# EasyEDA Pro project H桥.eprj, schematic 单相_TO220
Board Name: 单相_直插; Create Date: 2025-08-05; Page Name: P1; Project Name: H桥; Schematic Name: 单相_直插; Update Date: 2025-08-12; Company: 嘉立创EDA; Page Size: A4; Version: V1.0
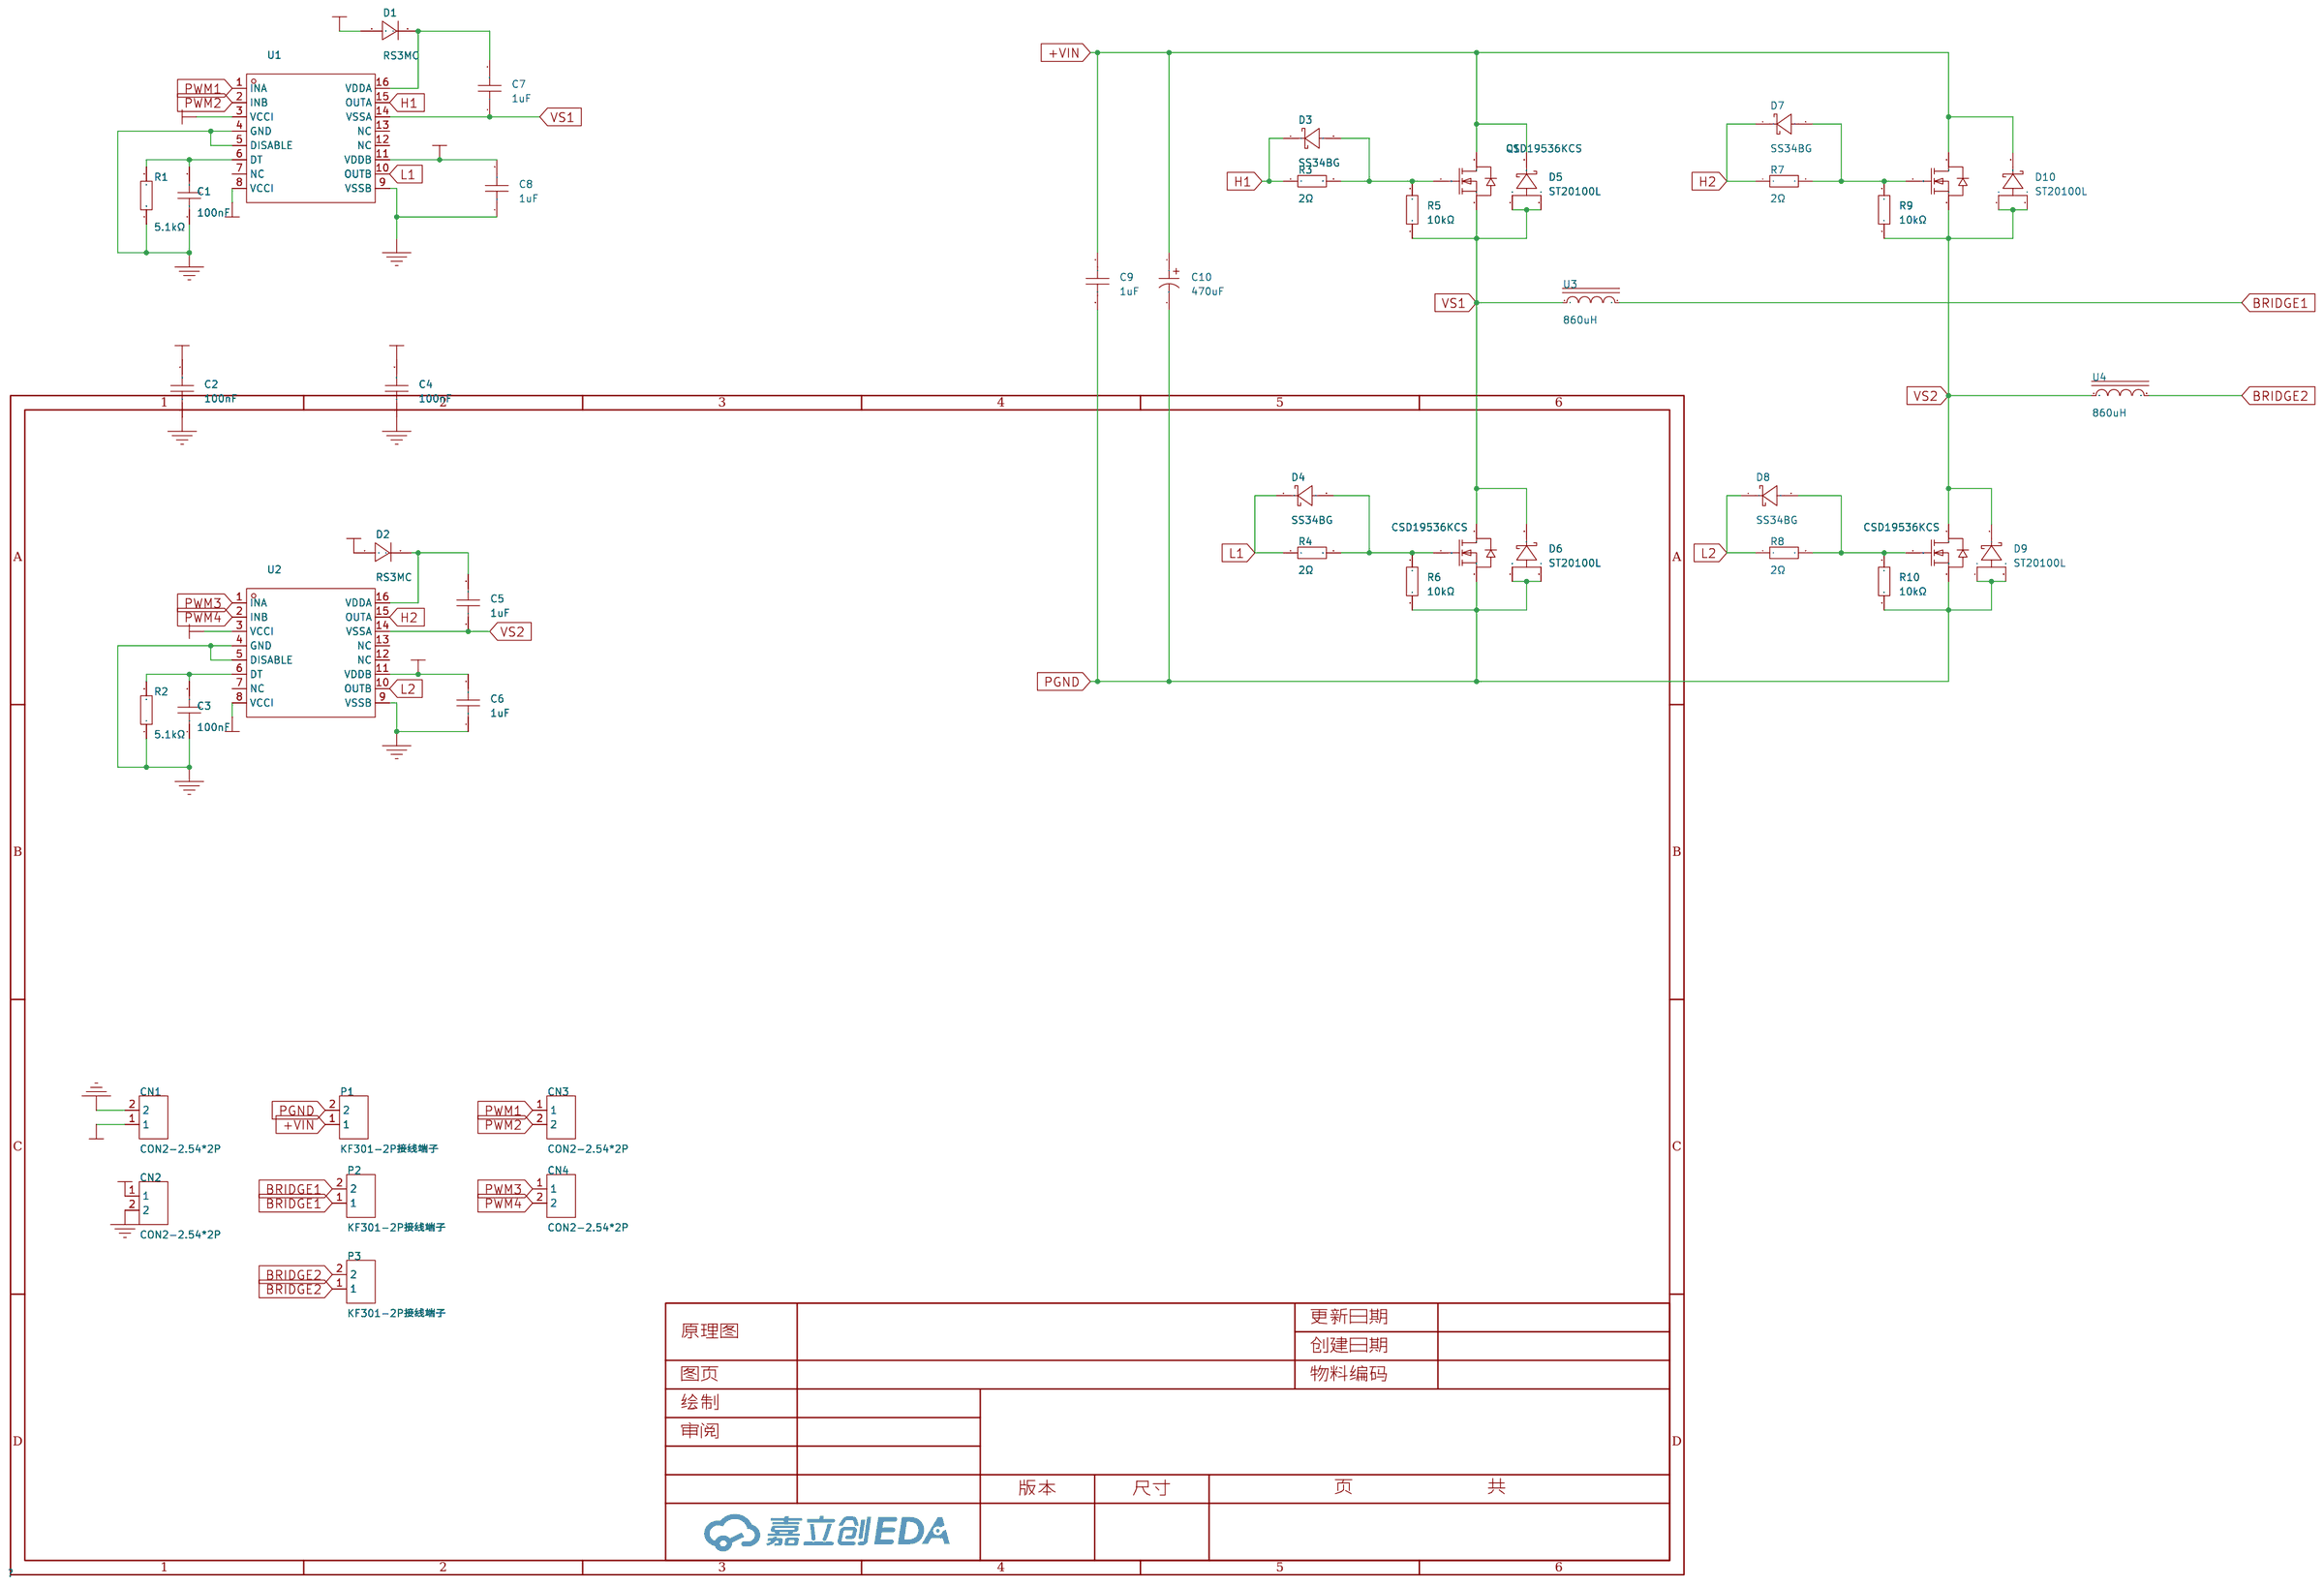
[diagram p0: schematic sheet]

## Parts
C1  100nF  [C0805]
C2  100nF  [C0805]
C3  100nF  [C0805]
C4  100nF  [C0805]
C5  1uF  [C0805]
C6  1uF  [C0805]
C7  1uF  [C0805]
C8  1uF  [C0805]
C9  1uF  [CAP-TH_L26.5-W10.0-P22.50-D1.4]
C10  470uF  [CAP-TH_BD16.0-P7.50-D1.2-FD]
CN1  CON2-2.54*2P  [CONN-TH_2P-P2.54-V]
CN2  CON2-2.54*2P  [CONN-TH_2P-P2.54-V]
CN3  CON2-2.54*2P  [CONN-TH_2P-P2.54-V]
CN4  CON2-2.54*2P  [CONN-TH_2P-P2.54-V]
D1  RS3MC  [SMC_L7.1-W6.2-LS8.1-R-RD]
D2  RS3MC  [SMC_L7.1-W6.2-LS8.1-R-RD]
D3  SS34BG  [SMB_L4.6-W3.6-LS5.3-RD]
D4  SS34BG  [SMB_L4.6-W3.6-LS5.3-RD]
D5  ST20100L  [TO-277_3P-L5.7-W4.2-LS6.5-BR]
D6  ST20100L  [TO-277_3P-L5.7-W4.2-LS6.5-BR]
D7  SS34BG  [SMB_L4.6-W3.6-LS5.3-RD]
D8  SS34BG  [SMB_L4.6-W3.6-LS5.3-RD]
D9  ST20100L  [TO-277_3P-L5.7-W4.2-LS6.5-BR]
D10  ST20100L  [TO-277_3P-L5.7-W4.2-LS6.5-BR]
P1  KF301-2P接线端子  [CONN-TH_XY301V-A-5.0-2P]
P2  KF301-2P接线端子  [CONN-TH_XY301V-A-5.0-2P]
P3  KF301-2P接线端子  [CONN-TH_XY301V-A-5.0-2P]
Q1  CSD19536KCS  [TO-220-3_L10.0-W4.5-P2.54-L]
Q2  CSD19536KCS  [TO-220-3_L10.0-W4.5-P2.54-L]
Q3  CSD19536KCS  [TO-220-3_L10.0-W4.5-P2.54-L]
Q4  CSD19536KCS  [TO-220-3_L10.0-W4.5-P2.54-L]
R1  20kΩ  [R0805]
R2  20kΩ  [R0805]
R3  2Ω  [R0805]
R4  2Ω  [R0805]
R5  10kΩ  [R0805]
R6  10kΩ  [R0805]
R7  2Ω  [R0805]
R8  2Ω  [R0805]
R9  10kΩ  [R0805]
R10  10kΩ  [R0805]
U1  UCC21520  [SOIC-16_L10.3-W7.5-P1.27-LS10.3-BL]
U2  UCC21520  [SOIC-16_L10.3-W7.5-P1.27-LS10.3-BL]
U3  860uH  [IND-TH_L29.0-W16.0-P14.00-D0.8]
U4  860uH  [IND-TH_L29.0-W16.0-P14.00-D0.8]

## Library data of the parts
C1 C3 = 1C25X7R473K100B: 容值:47nF;精度:±10%;额定电压:100V;温度系数:X7R;; LCSC Part Name: 47nF ±10% 100V; Supplier Part: C1630512; Manufacturer: VISHAY(威世); Supplier Footprint: 插件,P=6.35mm; JLCPCB Part Class: Extended Part; Datasheet: https://atta.szlcsc.com/upload/public/pdf/source/20210701/0CF1A7AD3406E72B391D35880AF61B15.pdf; Supplier: LCSC; Tolerance: ±10%; Voltage Rated: 100V; Temperature Coefficient: X7R
C2 C4-C8 = CAP_0805: Supplier Footprint: 0805
C9 = C322J474J90C000: LCSC Part Name: 470nF ±5% 630V; Supplier Part: C401319; Manufacturer: faratronic(厦门法拉); Supplier Footprint: 插件,P=22.5mm; JLCPCB Part Class: 扩展库; Datasheet: https://atta.szlcsc.com/upload/public/pdf/source/20190702/C401136_4E449A5F5E1485A05AFFA403AF8D4B3E.pdf; Supplier: LCSC; Tolerance: ±5%; Voltage Rated: 630V
C10 = CD11Z 100V470μF: 容值:470uF;额定电压:100V;纹波电流:-;等效串联电阻:-;; LCSC Part Name: 470uF 100V; Supplier Part: C1692765; Manufacturer: DMEGC(东磁); Supplier Footprint: 插件,D16xL25mm; JLCPCB Part Class: 扩展库; Datasheet: https://atta.szlcsc.com/upload/public/pdf/source/20210111/C1692765_3DA9E861BF574BA4CB3EF792989E2CF7.pdf; Supplier: LCSC; Rated Voltage: 100V
CN1-CN4 = CON2-2.54*2P: Supplier Part: C9900003238; Supplier Footprint: TH-2P; JLCPCB Part Class: Extended Part; Supplier: LCSC
D1 D2 = RS3MC_C15283: 二极管配置:独立式;正向压降(Vf):1.3V@3A;直流反向耐压(Vr):1kV;整流电流:3A;反向恢复时间(trr):500ns;; LCSC Part Name: 电压:1kV 电流:3A; Supplier Part: C15283; Manufacturer: MDD(辰达半导体); Supplier Footprint: SMC; JLCPCB Part Class: 扩展库; Datasheet: https://atta.szlcsc.com/upload/public/pdf/source/20240809/311FA8487617F5AA976E3BC15CA3A541.pdf; Supplier: LCSC; Diode Configuration: 独立式; Forward Voltage (Vf@If): 1.3V@3A; Reverse Voltage (Vr): 1kV; Rectified Current: 3A; Reverse Leakage Current: 5uA@1kV; Reverse Recovery Time (trr): 500ns; Operating Temperature: -55℃~+150℃@(Tj)
D3 D4 D7 D8 = SS34BG: LCSC Part Name: 电压:40V 电流:3A; Supplier Part: C719397; Manufacturer: SHIKUES(时科); Supplier Footprint: SMB; JLCPCB Part Class: 扩展库; Datasheet: https://atta.szlcsc.com/upload/public/pdf/source/20200825/C719396_E39605378EBDC67A0B7AD53C9B61FDD8.pdf; Supplier: LCSC; Diode Configuration: 独立式; Forward Voltage (Vf@If): 550mV@3A; Reverse Voltage (Vr): 40V; Average Rectified Current (Io): 3A; Reverse Leakage Current (Ir): 500uA@40V
D5 D6 D9 D10 = ST20100L: LCSC Part Name: 电压:100V 电流:20A; Supplier Part: C2693410; Manufacturer: CJ(江苏长电/长晶); Supplier Footprint: TO-277; JLCPCB Part Class: 扩展库; Datasheet: https://atta.szlcsc.com/upload/public/pdf/source/20210330/C2693410_9551F5ED840A67394421895091158B3C.pdf; Supplier: LCSC; Diode Configuration: 独立式; Voltage - Forward(Vf@If): 650mV@20A; Voltage - DC Reverse(Vr): 100V; Current - Rectified: 20A; Reverse Leakage Current (Ir): 30uA@100V
P1-P3 = KF301-2P接线端子: Supplier Part: C9900016950; Supplier Footprint: CK301-2P; JLCPCB Part Class: 扩展库; Supplier: LCSC
Q1-Q4 = CSD19536KCS: 类型:1个N沟道;漏源电压(Vdss):100V;连续漏极电流(Id):150A;功率(Pd):375W;导通电阻(RDS(on)@Vgs,Id):2.7mΩ@10V,100A;阈值电压(Vgs(th)@Id):3.2V@250uA;; LCSC Part Name: 1个N沟道 耐压:100V 电流:150A; Supplier Part: C206030; Manufacturer: TI(德州仪器); Supplier Footprint: TO-220; JLCPCB Part Class: 扩展库; Datasheet: https://www.ti.com/cn/lit/gpn/csd19536kcs; Supplier: LCSC; Type: 1个N沟道; Drain Source Voltage (Vdss): 100V; Continuous Drain Current (Id): 150A; Power Dissipation (Pd): 375W; Drain Source On Resistance (RDS(on)@Vgs,Id): 2.7mΩ@10V,100A; Gate Threshold Voltage (Vgs(th)@Id): 3.2V@250uA; Total Gate Charge (Qg@Vgs): 153nC@10V; Input Capacitance (Ciss@Vds): 12nF@50V; Operating Temperature: -55℃~+175℃@(Tj)
R1 R2 = 20kΩ: 电阻类型:金属膜电阻;阻值:20kΩ;精度:±1%;功率:500mW;温度系数:±50ppm/℃;; LCSC Part Name: 金属膜电阻 20kΩ ±1% 500mW; Supplier Part: C173146; Manufacturer: YAGEO(国巨); Manufacturer Part: MFR50SFTE52-20K; Supplier Footprint: 插件,D2.4xL6.3mm; JLCPCB Part Class: 扩展库; Datasheet: https://atta.szlcsc.com/upload/public/pdf/source/20191118/C457825_18355E864DE4965678DC27B0EBC3E21E.pdf; Supplier: LCSC; Type: 金属膜电阻; Tolerance: ±1%; Power(Watts): 500mW; Temperature Coefficient: ±50ppm/℃; Operating Temperature Range: -55℃~+155℃; Origin Footprint 2: RES-TH_BD2.4-L6.3-P10.30-D0.6; Origin Footprint 1: MFR50SFTE52-20K
R3-R10 = Res_AXIAL-1/8W: Supplier Footprint: 轴向引线
U1 U2 = UCC21520: Supplier: LCSC; Supplier Part: C601651; Manufacturer: TI(德州仪器); JLCPCB Part Class: Extended Part
U3 U4 = YDTC90125-861L: LCSC Part Name: TC90125 860uH@10KHz 150mΩ 3A; Supplier Part: C22395844; Manufacturer: YJYCOIN(益嘉源); Supplier Footprint: 插件,P=14mm; Datasheet: https://atta.szlcsc.com/upload/public/pdf/source/20240511/73FAF6FE8F8F84F1808BB18923905892.pdf; Supplier: LCSC; Tolerance: ±20%

## Nets
+5V: C2.2 CN2.1 U1.3(VCCI) U1.8(VCCI) U2.3(VCCI) U2.8(VCCI)
+12V: C4.2 C6.2 C8.2 CN1.1 D1.1(A) D2.1(A) U1.11(VDDB) U2.11(VDDB)
+VIN: C9.1 C10.1 D5.2(K) D10.2(K) P1.1 Q1.2(D) Q3.2(D)
DGND: C1.1 C2.1 C3.1 CN2.2 R1.1 R2.1 U1.4(GND) U1.5(DISABLE) U2.4(GND) U2.5(DISABLE)
PGND: C4.1 C6.1 C8.1 C9.2 C10.2 CN1.2 D6.1(A) D6.3(A) D9.1(A) D9.3(A) P1.2 Q2.3(S) Q4.3(S) R6.1 R10.1 U1.9(VSSB) U2.9(VSSB)
BRIDGE1: P2.1 P2.2 U3.2
BRIDGE2: P3.1 P3.2 U4.2
H1: D3.1(K) R3.1 U1.15(OUTA)
H2: D7.1(K) R7.1 U2.15(OUTA)
L1: D4.1(K) R4.1 U1.10(OUTB)
L2: D8.1(K) R8.1 U2.10(OUTB)
PWM1: CN3.1 U1.1(INA)
PWM2: CN3.2 U1.2(INB)
PWM3: CN4.1 U2.1(INA)
PWM4: CN4.2 U2.2(INB)
VS1: C7.1 D5.1(A) D5.3(A) D6.2(K) Q1.3(S) Q2.2(D) R5.1 U1.14(VSSA) U3.1
VS2: C5.1 D9.2(K) D10.1(A) D10.3(A) Q3.3(S) Q4.2(D) R9.1 U2.14(VSSA) U4.1
$1N1918: D4.2(A) Q2.1(G) R4.2 R6.2
$1N1920: D3.2(A) Q1.1(G) R3.2 R5.2
$1N1922: D7.2(A) Q3.1(G) R7.2 R9.2
$1N1924: D8.2(A) Q4.1(G) R8.2 R10.2
$1N1931: C3.2 R2.2 U2.6(DT)
$1N1939: C1.2 R1.2 U1.6(DT)
$1N1949: C5.2 D2.2(K) U2.16(VDDA)
$1N1950: C7.2 D1.2(K) U1.16(VDDA)

Not connected (* = marked no-connect by the designer): U1 7(NC) 12(NC) 13(NC); U2 7(NC) 12(NC) 13(NC)
